# Altium schematic sheet UD3c.SchDoc
size A1
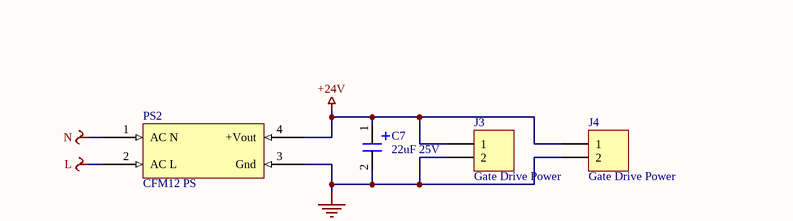
[diagram p0: UD3c.SchDoc, top left]
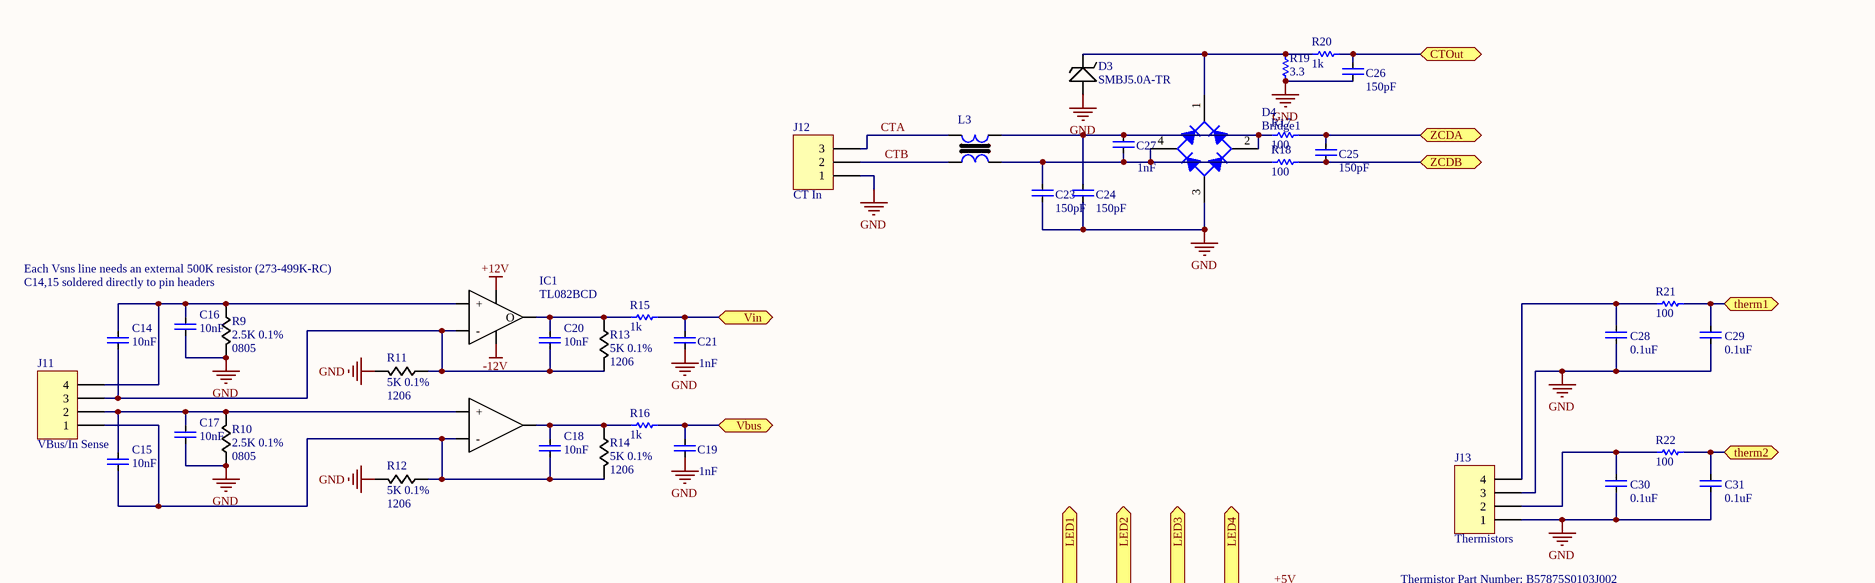
[diagram p1: UD3c.SchDoc, top right]
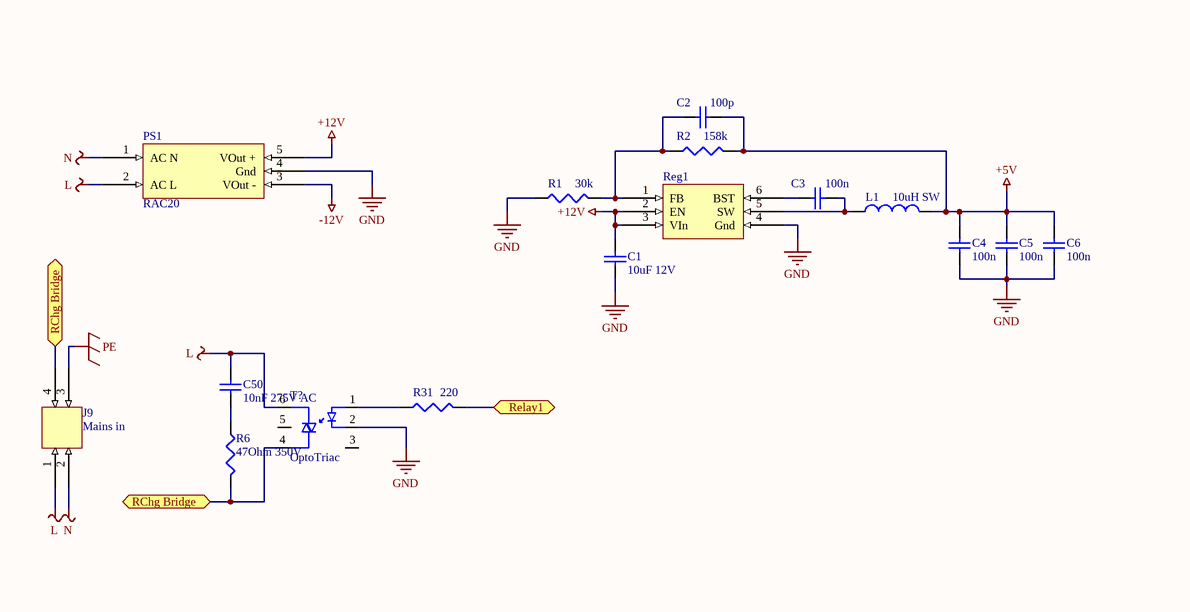
[diagram p2: UD3c.SchDoc, bottom left]
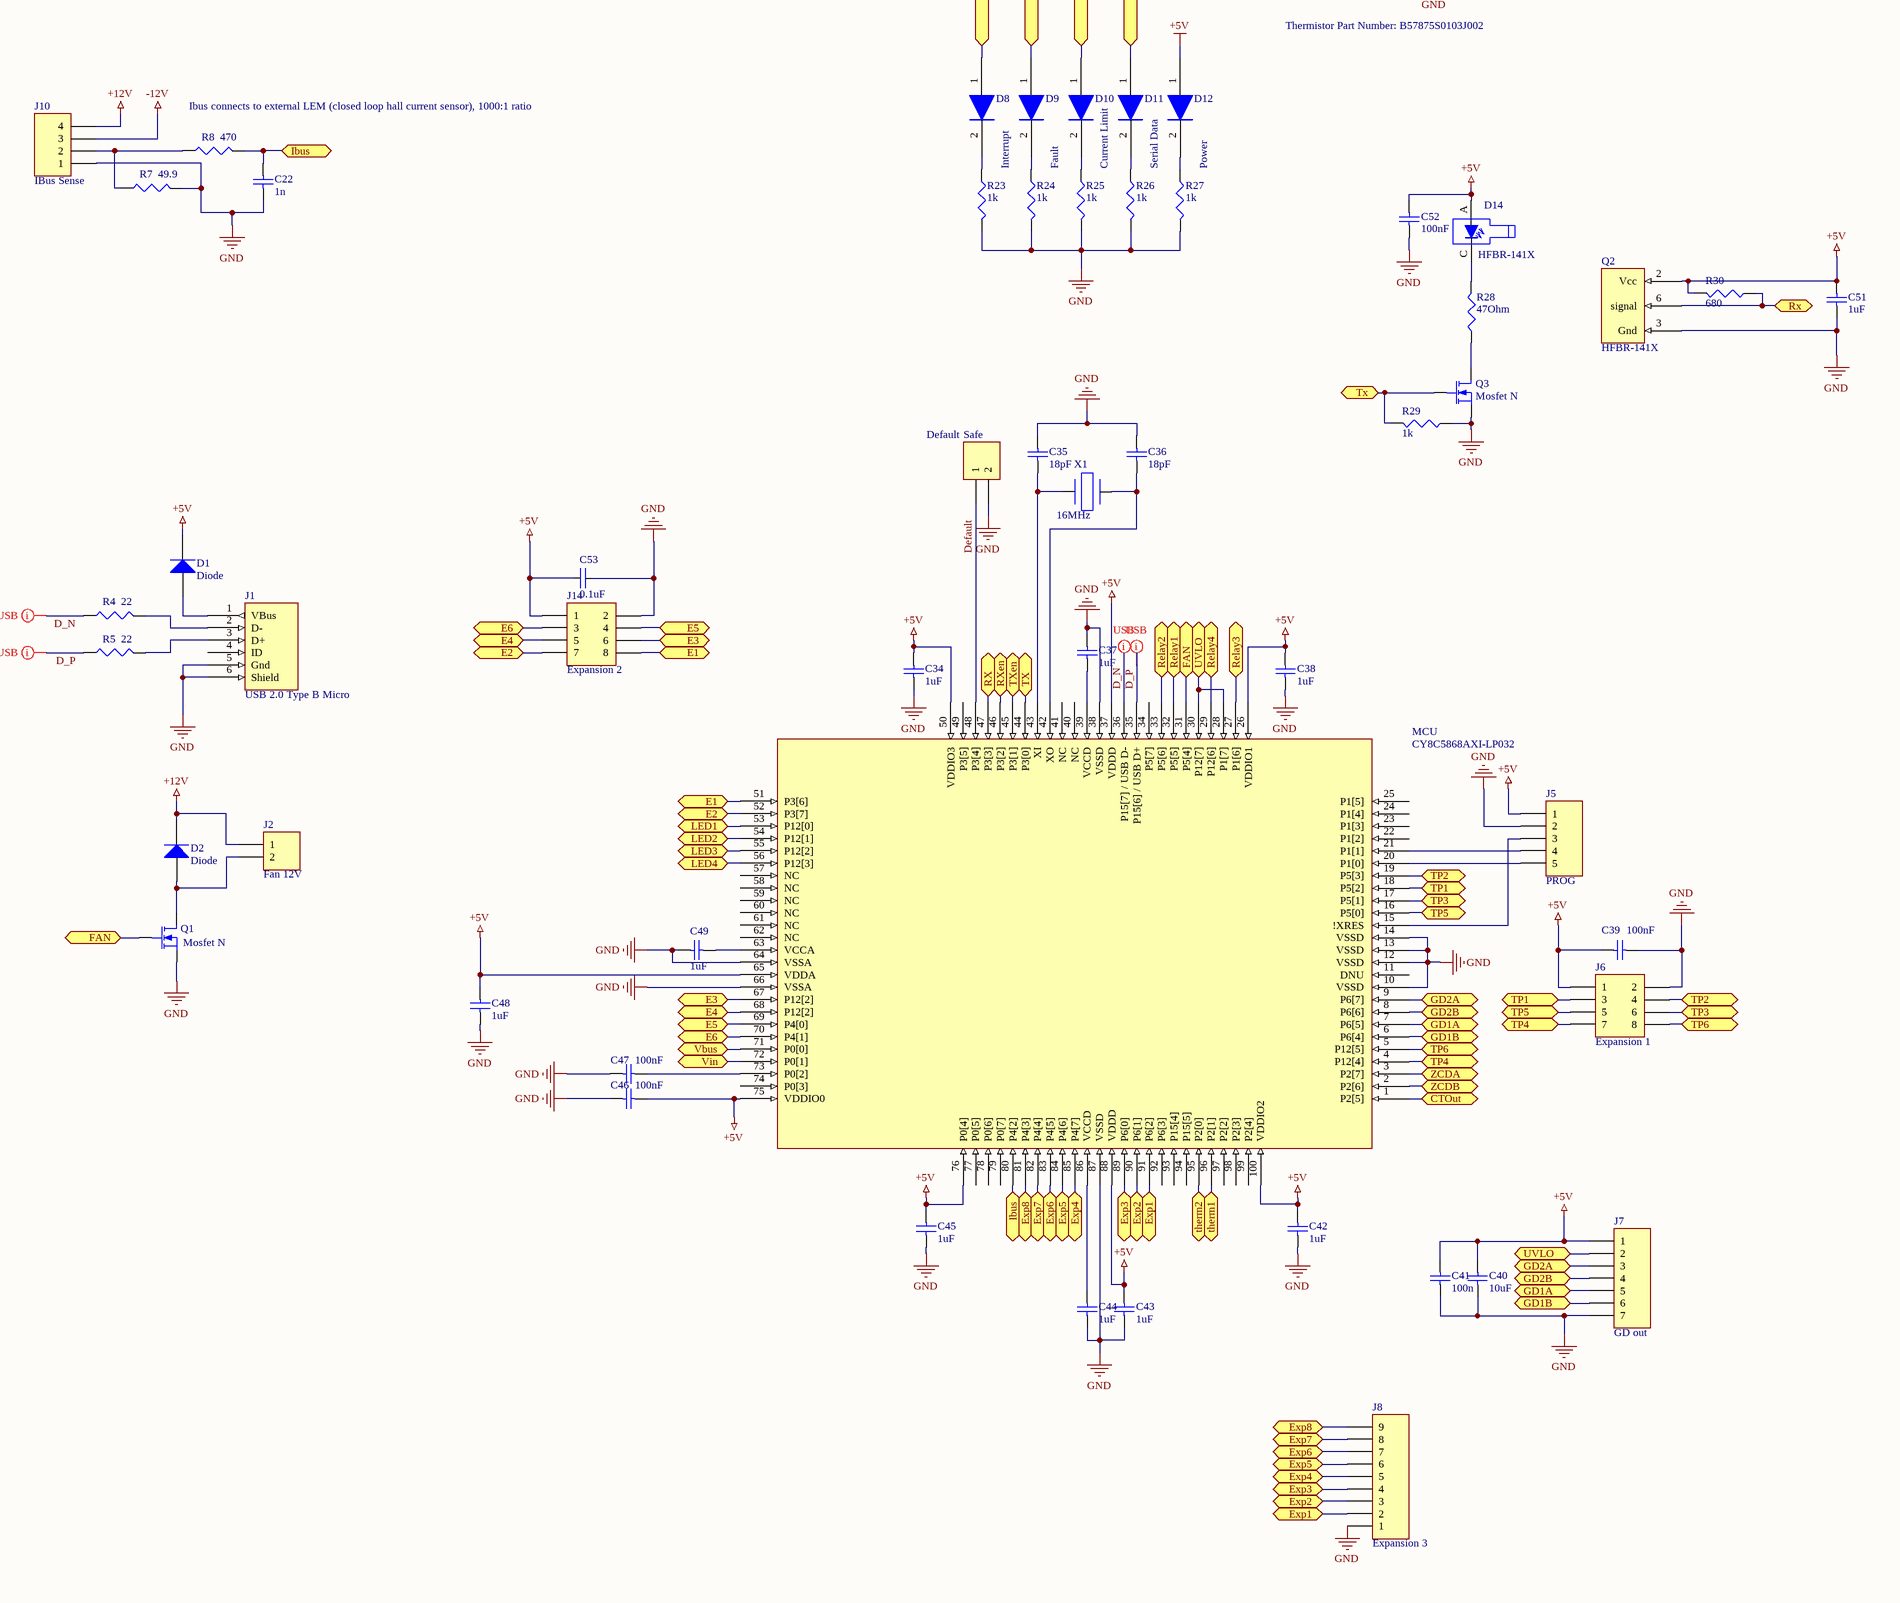
[diagram p3: UD3c.SchDoc, bottom right]

## Parts
C1  10uF 12V  [0805]
C2  100p  [0603]
C3  100n  [0603]
C4  100n  [0603]
C5  100n  [0603]
C6  100n  [0603]
C7  22uF 25V  [2917 Tantalum]
C14  value 10nF  [0603]  (hidden comment: C0805C103K1RACTU)
C15  value 10nF  [0603]  (hidden comment: C0805C103K1RACTU)
C16  value 10nF  [0603]  (hidden comment: C0805C103K1RACTU)
C17  value 10nF  [0603]  (hidden comment: C0805C103K1RACTU)
C18  value 10nF  [0603]  (hidden comment: C0805C103K1RACTU)
C19  value 1nF  [0603]  (hidden comment: C0805C102K5RACTU)
C20  value 10nF  [0603]  (hidden comment: C0805C103K1RACTU)
C21  value 1nF  [0603]  (hidden comment: C0805C102K5RACTU)
C22  1n  [0603]
C23  value 150pF  [0603]  (hidden comment: C0805C151J5GACTU)
C24  value 150pF  [0603]  (hidden comment: C0805C151J5GACTU)
C25  value 150pF  [0603]  (hidden comment: C0805C151J5GACTU)
C26  value 150pF  [0603]  (hidden comment: C0805C151J5GACTU)
C27  value 1nF  [0603]  (hidden comment: C0805C102K5RACTU)
C28  value 0.1uF  [0603]  (hidden comment: C0805C105K4RACTU)
C29  value 0.1uF  [0603]  (hidden comment: C0805C105K4RACTU)
C30  value 0.1uF  [0603]  (hidden comment: C0805C105K4RACTU)
C31  value 0.1uF  [0603]  (hidden comment: C0805C105K4RACTU)
C34  1uF  [0402]
C35  18pF  [0603]
C36  18pF  [0603]
C37  1uF  [0402]
C38  1uF  [0603]
C39  100nF  [0603]
C40  10uF  [0603]
C41  100n  [0603]
C42  1uF  [0402]
C43  1uF  [0402]
C44  1uF  [0402]
C45  1uF  [0603]
C46  100nF  [0603]
C47  100nF  [0402]
C48  1uF  [0402]
C49  1uF  [0402]
C50  10nF 275V AC  [Würth Film Cap 13x5]
C51  1uF  [0603]
C52  100nF  [0603]
C53  value 0.1uF  [0603]  (hidden comment: C0805C104K5RACTU)
D1  Diode  [DO-214]
D2  Diode  [DO-214]
D3  SMBJ5.0A-TR  [do-214]
D4  Bridge1  [MBS-2]
D8  Interrupt  [LED 5mm Right angle]
D9  Fault  [LED 5mm Right angle]
D10  Current Limit  [LED 5mm Right angle]
D11  Serial Data  [LED 5mm Right angle]
D12  Power  [LED 5mm Right angle]
D14  HFBR-141X  [HFBR-1414MZ]
IC1  TL082BCD  [SOIC8]
J1  USB 2.0 Type B Micro  [WM9734CT]
J2  Fan 12V  [HDR1X2]
J3  Gate Drive Power  [HDR1X2]
J4  Gate Drive Power  [HDR1X2]
J5  PROG  [HDR1X5]
J6  Expansion 1  [HDR2X4]
J7  GD out  [HDR1X7]
J8  Expansion 3  [HDR1X9]
J9  Mains in  [Micro Fit 4 Pin]
J10  IBus Sense  [HDR1X4]
J11  VBus/In Sense  [HDR1X4]
J12  CT In  [HDR1X3]
J13  Thermistors  [HDR1X4]
J14  Expansion 2  [HDR2X4]
L1  10uH SW  [1008]
L3  DLW5BTN501SQ2L  [SON127P600 4 POS (8.50mm x 5.60mm)]  (value not drawn)
MCU  CY8C5868AXI-LP032  [TQFP100]
PS1  RAC20  [RAC20 Power supply]
PS2  CFM12 PS  [IRM-20]
Q1  Mosfet N  [LFPAK56]
Q2  HFBR-141X  [HFBR-1414MZ - receiver]
Q3  Mosfet N  [sot 23]
R1  30k  [0603]
R2  158k  [0603]
R4  22  [0402]
R5  22  [0402]
R6  47Ohm 350V  [2512]
R7  49.9  [1206]
R8  470  [0603]
R9  Resistance: 2.5K 0.1%  [0805]  (hidden comment: RN732ATTD2501B25)
R10  Resistance: 2.5K 0.1%  [0805]  (hidden comment: RN732ATTD2501B25)
R11  Resistance: 5K 0.1%  Package: 1206  [0805]  (hidden comment: RN732BTTD5001B25)
R12  Resistance: 5K 0.1%  Package: 1206  [0805]  (hidden comment: RN732BTTD5001B25)
R13  Resistance: 5K 0.1%  Package: 1206  [0805]  (hidden comment: RN732BTTD5001B25)
R14  Resistance: 5K 0.1%  Package: 1206  [0805]  (hidden comment: RN732BTTD5001B25)
R15  value 1k  [0603]  (hidden comment: CRCW08051K00FKEA)
R16  value 1k  [0603]  (hidden comment: CRCW08051K00FKEA)
R17  value 100  [0603]  (hidden comment: CRCW0805100RFKEA)
R18  value 100  [0603]  (hidden comment: CRCW0805100RFKEA)
R19  value 3.3  [SQM-03 3W]  (hidden comment: 261-3.3-RC)
R20  value 1k  [0603]  (hidden comment: CRCW08051K00FKEA)
R21  value 100  [0603]  (hidden comment: CRCW0805100RFKEA)
R22  value 100  [0603]  (hidden comment: CRCW0805100RFKEA)
R23  1k  [0603]
R24  1k  [0603]
R25  1k  [0603]
R26  1k  [0603]
R27  1k  [0603]
R28  47Ohm  [0603]
R29  1k  [0603]
R30  680  [0603]
R31  220  [0603]
Reg1  Buck regulator  [TSOT26]  (value not drawn)
Safe  Default  [HDR1X2]
T?  OptoTriac  [Dip6]
X1  16MHz  [ECS-3225MV Oscillator]

## Ports
CTOut (bidir), E1 (bidir), E2 (bidir), E3 (bidir), E4 (bidir), E5 (bidir), E6 (bidir), Exp1 (bidir), Exp2 (bidir), Exp3 (bidir), Exp4 (bidir), Exp5 (bidir), Exp6 (bidir), Exp7 (bidir), Exp8 (bidir), FAN (bidir), GD1A (bidir), GD1B (bidir), GD2A (bidir), GD2B (bidir), Ibus (bidir), LED1 (bidir), LED2 (bidir), LED3 (bidir), LED4 (bidir), RChg Bridge (bidir), Relay1 (bidir), Relay2 (bidir), Relay3 (bidir), Relay4 (bidir), RX (bidir), Rx (bidir), RXen (bidir), therm1 (bidir), therm2 (bidir), TP1 (bidir), TP2 (bidir), TP3 (bidir), TP4 (bidir), TP5 (bidir), TP6 (bidir), TX (bidir), Tx (bidir), TXen (bidir), UVLO (bidir), Vbus (bidir), Vin (bidir), ZCDA (bidir), ZCDB (bidir)

## Nets
+5V: C2.1 C4.1 C5.1 C6.1 C34.2 C38.1 C39.1 C40.1 C41.1 C42.1 C43.1 C45.1 C46.2 C48.2 C51.1 C52.2 C53.2 D1.2(K) D12.1 D14.A J5.1 J6.1 J7.1 J14.1 L1.2 MCU.26(VDDIO1) MCU.37(VDDD) MCU.50(VDDIO3) MCU.65(VDDA) MCU.75(VDDIO0) MCU.76(P0[4]) MCU.88(VDDD) MCU.100(VDDIO2) Q2.2(Vcc) R2.2 R30.2
+12V: C1.2 D2.2(K) IC1.8(Vcc) J2.1 J10.4 PS1.5(VOut_+) Reg1.2(EN) Reg1.3(VIn)
+24V: C7.1 J3.1 J4.1 PS2.4(+Vout)
-12V: IC1.4(Vss) J10.3 PS1.3(VOut_-)
GND: C1.1 C4.2 C5.2 C6.2 C16.1 C17.1 C19.1 C21.1 C22.1 C23.1 C24.1 C26.1 C28.1 C29.1 C30.1 C31.1 C34.1 C35.2 C36.2 C37.2 C38.2 C39.2 C40.2 C41.2 C42.2 C43.2 C44.2 C45.2 C46.1 C47.1 C48.1 C49.1 C51.2 C52.1 C53.1 D3.1(A) D4.3(A) J1.5(Gnd) J1.6(Shield) J5.2 J6.2 J7.7 J8.1 J10.1 J12.1 J13.1 J13.3 J14.2 MCU.10(VSSD) MCU.12(VSSD) MCU.13(VSSD) MCU.14(VSSD) MCU.38(VSSD) MCU.64(VSSA) MCU.66(VSSA) MCU.87(VSSD) PS1.4(Gnd) Q1.S Q2.3(Gnd) Q3.S R1.1 R7.2 R9.1 R10.2 R11.1 R12.1 R19.1 R23.2 R24.2 R25.2 R26.2 R27.2 R29.1 Reg1.4(Gnd) Safe.2 T?.2(C)
HV_GND: C7.2 J3.2 J4.2 PS2.3(Gnd)
L: C50.2 J9.1 PS1.2(AC_L) PS2.2(AC_L) T?.6(MT2)
N: J9.2 PS1.1(AC_N) PS2.1(AC_N)
PE: J9.3
CTA: J12.3 L3.1
CTB: J12.2 L3.4
CTOut: C26.2 MCU.1(P2[5]) R20.2 ; port CTOut
D_N: MCU.36(P15[7]_/_USB_D-) R4.1
D_P: MCU.35(P15[6]_/_USB_D+) R5.1
Default: MCU.48(P3[4]) Safe.1
E1: J14.8 MCU.51(P3[6]) ; port E1
E2: J14.7 MCU.52(P3[7]) ; port E2
E3: J14.6 MCU.67(P12[2]) ; port E3
E4: J14.5 MCU.68(P12[2]) ; port E4
E5: J14.4 MCU.69(P4[0]) ; port E5
E6: J14.3 MCU.70(P4[1]) ; port E6
Exp1: J8.2 MCU.91(P6[2]) ; port Exp1
Exp2: J8.3 MCU.90(P6[1]) ; port Exp2
Exp3: J8.4 MCU.89(P6[0]) ; port Exp3
Exp4: J8.5 MCU.85(P4[7]) ; port Exp4
Exp5: J8.6 MCU.84(P4[6]) ; port Exp5
Exp6: J8.7 MCU.83(P4[5]) ; port Exp6
Exp7: J8.8 MCU.82(P4[4]) ; port Exp7
Exp8: J8.9 MCU.81(P4[3]) ; port Exp8
FAN: MCU.31(P5[4]) Q1.G ; port FAN
GD1A: J7.5 MCU.7(P6[5]) ; port GD1A
GD1B: J7.6 MCU.6(P6[4]) ; port GD1B
GD2A: J7.3 MCU.9(P6[7]) ; port GD2A
GD2B: J7.4 MCU.8(P6[6]) ; port GD2B
Ibus: C22.2 MCU.80(P4[2]) R8.2 ; port Ibus
LED1: D8.1 MCU.53(P12[0]) ; port LED1
LED2: D9.1 MCU.54(P12[1]) ; port LED2
LED3: D10.1 MCU.55(P12[2]) ; port LED3
LED4: D11.1 MCU.56(P12[3]) ; port LED4
RChg Bridge: J9.4 R6.1 T?.4(MT1) ; port RChg Bridge
Relay1: MCU.32(P5[5]) R31.2 ; port Relay1
Relay2: MCU.33(P5[6]) ; port Relay2
Relay3: MCU.27(P1[6]) ; port Relay3
Relay4: MCU.29(P12[6]) ; port Relay4
RX: MCU.47(P3[3]) Q2.6(signal) R30.1 ; port RX, port Rx
RXen: MCU.46(P3[2]) ; port RXen
therm1: C29.2 MCU.96(P2[1]) R21.2 ; port therm1
therm2: C31.2 MCU.95(P2[0]) R22.2 ; port therm2
TP1: J6.3 MCU.18(P5[2]) ; port TP1
TP2: J6.4 MCU.19(P5[3]) ; port TP2
TP3: J6.6 MCU.17(P5[1]) ; port TP3
TP4: J6.7 MCU.4(P12[4]) ; port TP4
TP5: J6.5 MCU.16(P5[0]) ; port TP5
TP6: J6.8 MCU.5(P12[5]) ; port TP6
TX: MCU.44(P3[0]) Q3.G R29.2 ; port TX, port Tx
TXen: MCU.45(P3[1]) ; port TXen
UVLO: J7.2 MCU.28(P1[7]) MCU.30(P12[7]) ; port UVLO
Vbus: C19.2 MCU.71(P0[0]) R16.2 ; port Vbus
Vin: C21.2 MCU.72(P0[1]) R15.2 ; port Vin
ZCDA: C25.2 MCU.3(P2[7]) R17.2 ; port ZCDA
ZCDB: C25.1 MCU.2(P2[6]) R18.2 ; port ZCDB
NetC2_2: C2.2 R1.2 R2.1 Reg1.1(FB)
NetC3_1: C3.1 Reg1.6(BST)
NetC3_2: C3.2 L1.1 Reg1.5(SW)
NetC14_1: C14.1 C20.1 IC1.2(-) J11.3 R11.2 R13.1
NetC14_2: C14.2 C16.2 IC1.3(+) J11.4 R9.2
NetC15_1: C15.1 C18.1 IC1.6(-) J11.1 R12.2 R14.1
NetC15_2: C15.2 C17.2 IC1.5(+) J11.2 R10.1
NetC18_2: C18.2 IC1.7(O) R14.2 R16.1
NetC20_2: C20.2 IC1.1(O) R13.2 R15.1
NetC23_2: C23.2 C27.1 D4.4(C) L3.3 R18.1
NetC24_2: C24.2 C27.2 D4.2(C) L3.2 R17.1
NetC28_2: C28.2 J13.4 R21.1
NetC30_2: C30.2 J13.2 R22.1
NetC35_1: C35.1 MCU.43(XI) X1.2
NetC36_1: C36.1 MCU.42(XO) X1.1
NetC37_1: C37.1 MCU.39(VCCD)
NetC44_1: C44.1 MCU.86(VCCD)
NetC47_2: C47.2 MCU.73(P0[2])
NetC49_2: C49.2 MCU.63(VCCA)
NetC50_1: C50.1 R6.2
NetD1_1: D1.1(A) J1.1(VBus)
NetD2_1: D2.1(A) J2.2 Q1.D
NetD3_2: D3.2(K) D4.1(K) R19.2 R20.1
NetD8_2: D8.2 R23.1
NetD9_2: D9.2 R24.1
NetD10_2: D10.2 R25.1
NetD11_2: D11.2 R26.1
NetD12_2: D12.2 R27.1
NetD14_C: D14.C R28.2
NetJ1_2: J1.2(D-) R4.2
NetJ1_3: J1.3(D+) R5.2
NetJ5_3: J5.3 MCU.15(!XRES)
NetJ5_4: J5.4 MCU.21(P1[1])
NetJ5_5: J5.5 MCU.20(P1[0])
NetJ10_2: J10.2 R7.1 R8.1
NetQ3_D: Q3.D R28.1
NetR31_1: R31.1 T?.1(A)

Not connected (* = marked no-connect by the designer): J1 4(ID); MCU 11(DNU) 22(P1[2]) 23(P1[3]) 24(P1[4]) 25(P1[5]) 34(P5[7]) 40(NC) 41(NC) 49(P3[5]) 57(NC) 58(NC) 59(NC) 60(NC) 61(NC) 62(NC) 74(P0[3]) 77(P0[5]) 78(P0[6]) 79(P0[7]) 92(P6[3]) 93(P15[4]) 94(P15[5]) 97(P2[2]) 98(P2[3]) 99(P2[4]); T? 3(NC) 5(NC)

## Layout directives
differential pair: D_N, D_P

## Notes on the sheet
- Each Vsns line needs an external 500K resistor (273-499K-RC)
- C14,15 soldered directly to pin headers
- Thermistor Part Number: B57875S0103J002
- (near R8) Ibus connects to external LEM (closed loop hall current sensor), 1000:1 ratio

## Library data of the parts
C1-C6 C22 C34-C52 = Cap: Supplier 1: Digi-Key; Supplier 2: Digi-Key; Supplier 3: Digi-Key; Supplier Part Number 1: 1276-2044-1-ND; Supplier Part Number 2: 1276-1018-1-ND; Supplier Part Number 3: 1276-1182-1-ND; Supplier 4: Digi-Key; Supplier 5: Digi-Key; Supplier 6: Digi-Key; Supplier 7: Digi-Key; Supplier 8: Digi-Key; Supplier 9: Digi-Key; Supplier Part Number 4: 1276-1009-1-ND; Supplier Part Number 5: 1276-1098-1-ND; Supplier Part Number 6: 1276-1119-1-ND; Supplier Part Number 7: 490-12737-1-ND; Supplier Part Number 9: 587-1249-1-ND; Supplier Part Number 8: 1276-1183-1-ND; Supplier 10: Digi-Key; Supplier 11: Digi-Key; Supplier 12: Digi-Key; Supplier 13: Digi-Key; Supplier Part Number 10: 1276-CL10B104KB8NNNLCT-ND; Supplier Part Number 11: 399-1085-1-ND; Supplier Part Number 12: 1276-1021-1-ND; Supplier Part Number 13: 587-2985-1-ND
  C2-C6 C22 C34-C52: Supplier 14: Digi-Key; Supplier 15: Digi-Key; Supplier 16: Digi-Key; Supplier 17: Digi-Key; Supplier 18: Digi-Key; Supplier 19: Digi-Key; Supplier Part Number 14: 490-14603-1-ND; Supplier Part Number 15: 311-3700-1-ND; Supplier Part Number 16: 311-1042-1-ND; Supplier Part Number 17: 311-1415-1-ND; Supplier Part Number 19: 587-4321-1-ND; Supplier Part Number 18: 1276-1907-1-ND; Supplier 20: Digi-Key; Supplier 21: Digi-Key; Supplier 22: Digi-Key; Supplier Part Number 20: 1276-6767-1-ND; Supplier Part Number 21: 1276-7060-1-ND; Supplier Part Number 22: 311-1084-1-ND
C7 = Cap Polar: Supplier 1: Digi-Key; Supplier Part Number 1: 478-9181-1-ND; Supplier 2: Digi-Key; Supplier 3: Digi-Key; Supplier Part Number 2: 478-9173-1-ND; Supplier Part Number 3: 493-11037-ND; Supplier 4: Digi-Key; Supplier 5: Digi-Key; Supplier Part Number 4: PCE3462CT-ND; Supplier Part Number 5: 399-18864-1-ND; Supplier 6: Digi-Key; Supplier Part Number 6: 399-10512-1-ND
C14-C18 C20 = C0805C103K1RACTU: Capacitor, 10nF, MLCC, 50V, X7R, 10%, SMD
C19 C21 C27 = C0805C102K5RACTU: Capacitor, 1nF, MLCC, 50V, X7R, 10%, SMD
C23-C26 = C0805C151J5GACTU: Capacitor, 150pF, MLCC, 50V, COG, 5%, SMD
C28-C31 = C0805C105K4RACTU: Capacitor, 1uF, MLCC, 16V, X7R, 10%, SMD
C53 = C0805C104K5RACTU: Capacitor, 0.1uF, MLCC, 50V, X7R, 10%, SMD
D1 D2 = Diode: Default Diode; Published: 8-Jun-2000; LatestRevisionDate: 17-Jul-2002; LatestRevisionNote: Re-released for DXP Platform.; PackageVersion: Sep-1996; PackageReference: SMC; Publisher: Altium Limited; PackageDescription: DO-214-AB/SMC; 2 C-Bend Leads; Body 7.9 x 5.9 mm, inc. leads (LxW); Code_JEDEC: DO-214-AB
D3 = SMBJ170A
D4 = Bridge1: Full Wave Diode Bridge; pin to pad: 1>3 3>4 4>1; Published: 8-Jun-2000; LatestRevisionDate: 29-May-2009; LatestRevisionNote: Sch pins A & K swapped.; DatasheetVersion: E2732B; PackageReference: D-38; Publisher: Altium Limited; PackageDescription: Bridge Rectifier; 4 Terminals; Body 9.4 x 9.4 mm (typ); Pitch 5.08 mm
D8-D12 = LED: Supplier 1: Digi-Key; Supplier 2: Digi-Key; Supplier 3: Digi-Key; Supplier 4: Digi-Key; Supplier Part Number 1: 732-4979-1-ND; Supplier Part Number 2: 732-4971-1-ND; Supplier Part Number 3: 732-4966-1-ND; Supplier Part Number 4: 732-4981-1-ND
D14 = HFBR-141X: Fiber optic transmitter. ST connector; Supplier 1: Digi-Key; Supplier Part Number 1: 516-2038-ND
IC1 = TL082
J2-J4 Safe = Header 2: Header, 2-Pin; LatestRevisionDate: 17-Jul-2002; LatestRevisionNote: Re-released for DXP Platform.; Publisher: Altium Limited
J5 = Header 5: Header, 5-Pin; LatestRevisionDate: 17-Jul-2002; LatestRevisionNote: Re-released for DXP Platform.; Publisher: Altium Limited
J6 J14 = Header 4X2: Header, 4-Pin, Dual row; LatestRevisionDate: 17-Jul-2002; LatestRevisionNote: Re-released for DXP Platform.; Publisher: Altium Limited
J7 = Header 7: Header, 7-Pin; LatestRevisionDate: 17-Jul-2002; LatestRevisionNote: Re-released for DXP Platform.; Publisher: Altium Limited
J8 = Header 9: Header, 9-Pin; LatestRevisionDate: 17-Jul-2002; LatestRevisionNote: Re-released for DXP Platform.; Publisher: Altium Limited
J9 = Molex MicroFit 4 Pin: Supplier 1: Digi-Key; Supplier Part Number 1: WM1814-ND
J10 J11 J13 = Header 4: Header, 4-Pin; LatestRevisionDate: 17-Jul-2002; LatestRevisionNote: Re-released for DXP Platform.; Publisher: Altium Limited
J12 = Header 3: Header, 3-Pin; LatestRevisionDate: 17-Jul-2002; LatestRevisionNote: Re-released for DXP Platform.; Publisher: Altium Limited
L1 = Inductor: Supplier 1: Digi-Key; Supplier 2: Digi-Key; Supplier Part Number 1: 541-1250-1-ND; Supplier Part Number 2: 541-1253-1-ND; Supplier 3: Digi-Key; Supplier 4: Digi-Key; Supplier Part Number 3: SRN6028-3R9MCT-ND; Supplier Part Number 4: SRN6028-4R7MCT-ND; Supplier 5: Digi-Key; Supplier 6: Digi-Key; Supplier 7: Digi-Key; Supplier 8: Digi-Key; Supplier 9: Digi-Key; Supplier 10: Digi-Key; Supplier 11: Digi-Key; Supplier Part Number 5: 490-10563-1-ND; Supplier Part Number 6: 1276-6932-1-ND; Supplier Part Number 7: 587-2042-1-ND; Supplier Part Number 8: 535-12790-1-ND; Supplier Part Number 9: SRP1265A-1R0MCT-ND; Supplier Part Number 10: SRP1770TA-5R6MCT-ND; Supplier Part Number 11: SRN6028-100MCT-ND
L3 = common mode choke: pin to pad: 1>3 2>1 3>2
PS1 = RAC20 Power supply: Supplier 1: Digi-Key; Supplier Part Number 1: 945-3239-ND
PS2 = CFM12 power supply: Supplier 1: Digi-Key; Supplier Part Number 1: 2034-3524-ND
Q2 = HFBR-141X_receiver: Fiber optic transmitter. ST connector; Supplier 1: Digi-Key; Supplier Part Number 1: 516-2038-ND
Q3 = Mosfet N: pin to pad: D>3 G>1 S>2; Supplier 1: Digi-Key; Supplier Part Number 1: 1727-5305-1-ND; Supplier 2: Digi-Key; Supplier Part Number 2: 1727-1123-1-ND; Supplier 3: Digi-Key; Supplier 4: Digi-Key; Supplier Part Number 4: T2N7002AKLMCT-ND; Supplier Part Number 3: BSC0906NSATMA1CT-ND; Supplier 5: Digi-Key; Supplier Part Number 5: 1727-4714-1-ND
R1 R2 R4-R14 R23-R31 = Resistor
  R1 R2 R31: Supplier 1: Digi-Key; Supplier 2: Digi-Key; Supplier Part Number 1: RHM10DCT-ND; Supplier Part Number 2: 696-1834-1-ND; Supplier 3: Digi-Key; Supplier 4: Digi-Key; Supplier 5: Digi-Key; Supplier 6: Digi-Key; Supplier 7: Digi-Key; Supplier Part Number 3: RMCF0603JT3K90CT-ND; Supplier Part Number 5: RHM100DCT-ND; Supplier Part Number 6: RMCF0603FT54K9CT-ND; Supplier Part Number 7: RMCF0603FT40K2CT-ND; Supplier Part Number 4: RHM1.0KDCT-ND; Supplier 8: Digi-Key; Supplier 9: Digi-Key; Supplier 10: Digi-Key; Supplier 11: Digi-Key; Supplier Part Number 10: 311-200JRCT-ND; Supplier Part Number 11: 311-300JRCT-ND; Supplier Part Number 8: P200LCT-ND; Supplier Part Number 9: 311-1.0KJRCT-ND; Supplier 12: Digi-Key; Supplier 13: Digi-Key; Supplier 14: Digi-Key; Supplier 15: Digi-Key; Supplier 16: Digi-Key; Supplier 17: Digi-Key; Supplier Part Number 12: YAG3356CT-ND; Supplier Part Number 13: 311-220GRCT-ND; Supplier Part Number 14: 311-220KGRCT-ND; Supplier Part Number 15: 311-1.0KGRCT-ND; Supplier Part Number 16: 311-200KHRCT-ND; Supplier Part Number 17: A102451-ND; Supplier 18: Digi-Key; Supplier Part Number 18: 311-2.00KHRCT-ND; Supplier 19: Digi-Key; Supplier Part Number 19: 311-10KGRCT-ND; Supplier 20: Digi-Key; Supplier 21: Digi-Key; Supplier 22: Digi-Key; Supplier 23: Digi-Key; Supplier 24: Digi-Key; Supplier 25: Digi-Key; Supplier 26: Digi-Key; Supplier 27: Digi-Key; Supplier 28: Digi-Key; Supplier 29: Digi-Key; Supplier Part Number 29: 311-499KLRCT-ND; Supplier Part Number 28: 311-200KJRCT-ND; Supplier Part Number 26: YAG3226CT-ND; Supplier Part Number 20: 311-1.00LRCT-ND; Supplier Part Number 25: 311-12KJRCT-ND; Supplier Part Number 24: 311-10.0KLRCT-ND; Supplier Part Number 23: 311-4.7KJRCT-ND; Supplier Part Number 22: 311-2.2KJRCT-ND; Supplier Part Number 21: 311-220JRCT-ND; Supplier Part Number 27: 311-75KJRCT-ND; Supplier 30: Digi-Key; Supplier 31: Digi-Key; Supplier 32: Digi-Key; Supplier Part Number 30: YAG6087CT-ND; Supplier Part Number 31: 696-1677-1-ND; Supplier Part Number 32: 541-3127-6-ND; Supplier 33: Digi-Key; Supplier 34: Digi-Key; Supplier 35: Digi-Key; Supplier 36: Digi-Key; Supplier 37: Digi-Key; Supplier 38: Digi-Key; Supplier 39: Digi-Key; Supplier 40: Digi-Key; Supplier 41: Digi-Key; Supplier 42: Arrow; Supplier Part Number 33: 311-47.0HRCT-ND; Supplier Part Number 34: 311-470HRCT-ND; Supplier Part Number 35: 311-470KGRCT-ND; Supplier Part Number 36: 311-100KGRCT-ND; Supplier Part Number 37: 311-5.23KHRCT-ND; Supplier Part Number 38: 311-52.3KHRCT-ND; Supplier Part Number 39: 311-22KGRCT-ND; Supplier Part Number 40: 311-15.8KHRCT-ND; Supplier Part Number 41: 311-7.15KHRCT-ND; Supplier Part Number 42: RC0603FR-072K2L
  R4-R8 R28-R30: Supplier 1: Digi-Key; Supplier 2: Digi-Key; Supplier Part Number 1: RHM10DCT-ND; Supplier Part Number 2: 696-1834-1-ND; Supplier 3: Digi-Key; Supplier 4: Digi-Key; Supplier 5: Digi-Key; Supplier 6: Digi-Key; Supplier 7: Digi-Key; Supplier Part Number 3: RMCF0603JT3K90CT-ND; Supplier Part Number 5: RHM100DCT-ND; Supplier Part Number 6: RMCF0603FT54K9CT-ND; Supplier Part Number 7: RMCF0603FT40K2CT-ND; Supplier Part Number 4: RHM1.0KDCT-ND; Supplier 8: Digi-Key; Supplier 9: Digi-Key; Supplier 10: Digi-Key; Supplier 11: Digi-Key; Supplier Part Number 10: 311-200JRCT-ND; Supplier Part Number 11: 311-300JRCT-ND; Supplier Part Number 8: P200LCT-ND; Supplier Part Number 9: 311-1.0KJRCT-ND; Supplier 12: Digi-Key; Supplier 13: Digi-Key; Supplier 14: Digi-Key; Supplier 15: Digi-Key; Supplier 16: Digi-Key; Supplier 17: Digi-Key; Supplier Part Number 12: YAG3356CT-ND; Supplier Part Number 13: 311-220GRCT-ND; Supplier Part Number 14: 311-220KGRCT-ND; Supplier Part Number 15: 311-1.0KGRCT-ND; Supplier Part Number 16: 311-200KHRCT-ND; Supplier Part Number 17: A102451-ND; Supplier 18: Digi-Key; Supplier Part Number 18: 311-2.00KHRCT-ND; Supplier 19: Digi-Key; Supplier Part Number 19: 311-10KGRCT-ND; Supplier 20: Digi-Key; Supplier 21: Digi-Key; Supplier 22: Digi-Key; Supplier 23: Digi-Key; Supplier 24: Digi-Key; Supplier 25: Digi-Key; Supplier 26: Digi-Key; Supplier 27: Digi-Key; Supplier 28: Digi-Key; Supplier 29: Digi-Key; Supplier Part Number 29: 311-499KLRCT-ND; Supplier Part Number 28: 311-200KJRCT-ND; Supplier Part Number 26: YAG3226CT-ND; Supplier Part Number 20: 311-1.00LRCT-ND; Supplier Part Number 25: 311-12KJRCT-ND; Supplier Part Number 24: 311-10.0KLRCT-ND; Supplier Part Number 23: 311-4.7KJRCT-ND; Supplier Part Number 22: 311-2.2KJRCT-ND; Supplier Part Number 21: 311-220JRCT-ND; Supplier Part Number 27: 311-75KJRCT-ND; Supplier 30: Digi-Key; Supplier 31: Digi-Key; Supplier 32: Digi-Key; Supplier Part Number 32: 541-3127-6-ND; Supplier Part Number 31: 696-1677-1-ND; Supplier Part Number 30: YAG6087CT-ND; Supplier 33: Digi-Key; Supplier 34: Digi-Key; Supplier 35: Digi-Key; Supplier 36: Digi-Key; Supplier 37: Digi-Key; Supplier 38: Digi-Key; Supplier 39: Digi-Key; Supplier 40: Digi-Key; Supplier 41: Digi-Key; Supplier 42: Arrow; Supplier Part Number 33: 311-47.0HRCT-ND; Supplier Part Number 34: 311-470HRCT-ND; Supplier Part Number 37: 311-5.23KHRCT-ND; Supplier Part Number 36: 311-100KGRCT-ND; Supplier Part Number 35: 311-470KGRCT-ND; Supplier Part Number 38: 311-52.3KHRCT-ND; Supplier Part Number 39: 311-22KGRCT-ND; Supplier Part Number 41: 311-7.15KHRCT-ND; Supplier Part Number 42: RC0603FR-072K2L; Supplier Part Number 40: 311-15.8KHRCT-ND
  R9 R10: Package: 0805; Power: *
  R11-R14: Power: *
  R23-R27: Supplier 1: Digi-Key; Supplier 2: Digi-Key; Supplier Part Number 1: RHM10DCT-ND; Supplier Part Number 2: 696-1834-1-ND; Supplier 3: Digi-Key; Supplier 4: Digi-Key; Supplier 5: Digi-Key; Supplier 6: Digi-Key; Supplier 7: Digi-Key; Supplier Part Number 3: RMCF0603JT3K90CT-ND; Supplier Part Number 5: RHM100DCT-ND; Supplier Part Number 6: RMCF0603FT54K9CT-ND; Supplier Part Number 7: RMCF0603FT40K2CT-ND; Supplier Part Number 4: RHM1.0KDCT-ND; Supplier 8: Digi-Key; Supplier 9: Digi-Key; Supplier 10: Digi-Key; Supplier 11: Digi-Key; Supplier Part Number 10: 311-200JRCT-ND; Supplier Part Number 11: 311-300JRCT-ND; Supplier Part Number 8: P200LCT-ND; Supplier Part Number 9: 311-1.0KJRCT-ND; Supplier 12: Digi-Key; Supplier 13: Digi-Key; Supplier 14: Digi-Key; Supplier 15: Digi-Key; Supplier 16: Digi-Key; Supplier 17: Digi-Key; Supplier Part Number 12: YAG3356CT-ND; Supplier Part Number 13: 311-220GRCT-ND; Supplier Part Number 14: 311-220KGRCT-ND; Supplier Part Number 15: 311-1.0KGRCT-ND; Supplier Part Number 16: 311-200KHRCT-ND; Supplier Part Number 17: A102451-ND; Supplier 18: Digi-Key; Supplier Part Number 18: 311-2.00KHRCT-ND; Supplier 19: Digi-Key; Supplier Part Number 19: 311-10KGRCT-ND
R15-R18 R20-R22 = CRCW08051K00FKEA: Resistor, Thick Film, 1K, 1/8W, 150V, 1%, SMD
R19 = CMF60100R00JKEA: Resistor, 100 Ohm, 1/2W, 500V, 5%
Reg1 = AP6320: Supplier 1: Digi-Key; Supplier Part Number 1: AP63203WU-7DICT-ND; Supplier 2: Digi-Key; Supplier Part Number 2: AP63200WU-7DICT-ND; Supplier 3: Digi-Key; Supplier Part Number 3: AP63201WU-7DICT-ND
X1 = Quarz crystal: pin to pad: 1>2 2>4; Supplier 1: Digi-Key; Supplier Part Number 1: SER4069TR-ND
Q1 = Mosfet N: Supplier 1: Digi-Key; Supplier Part Number 1: 1727-5305-1-ND; Supplier 2: Digi-Key; Supplier Part Number 2: 1727-1123-1-ND; Supplier 3: Digi-Key; Supplier 4: Digi-Key; Supplier Part Number 4: T2N7002AKLMCT-ND; Supplier Part Number 3: BSC0906NSATMA1CT-ND; Supplier 5: Digi-Key; Supplier Part Number 5: 1727-4714-1-ND
T? = OptoTriac: Supplier 1: Digi-Key; Supplier Part Number 1: VO3023-ND